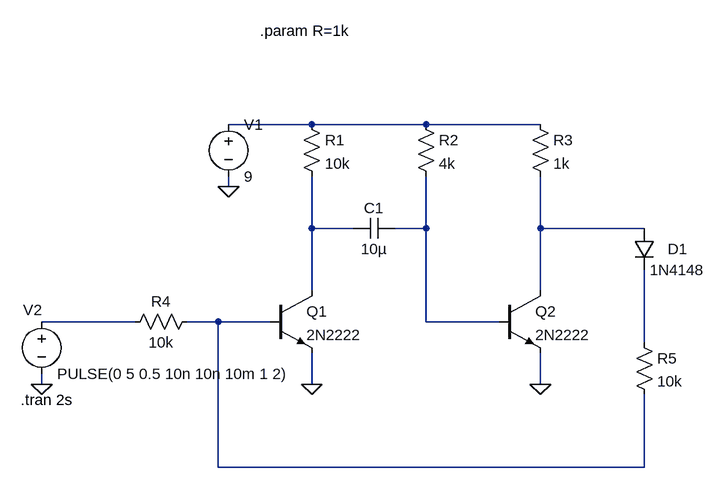
[diagram p0: schematic pulse_generator.asc]
pulse_generator.asc, the LTspice schematic file:
Version 4
SHEET 1 880 740
WIRE 32 64 -96 64
WIRE 208 64 32 64
WIRE 384 64 208 64
WIRE -96 160 -96 144
WIRE 32 224 32 144
WIRE 96 224 32 224
WIRE 208 224 208 144
WIRE 208 224 160 224
WIRE 384 224 384 144
WIRE 544 224 384 224
WIRE 32 320 32 224
WIRE 384 320 384 224
WIRE -240 368 -384 368
WIRE -112 368 -160 368
WIRE -32 368 -112 368
WIRE 208 368 208 224
WIRE 320 368 208 368
WIRE 544 400 544 288
WIRE -384 464 -384 448
WIRE 32 464 32 416
WIRE 384 464 384 416
WIRE -112 592 -112 368
WIRE 544 592 544 480
WIRE 544 592 -112 592
FLAG 32 464 0
FLAG 384 464 0
FLAG -96 160 0
FLAG -384 464 0
SYMBOL res 16 48 R0
SYMATTR InstName R1
SYMATTR Value 10k
SYMBOL res 192 48 R0
SYMATTR InstName R2
SYMATTR Value 4k
SYMBOL res 368 48 R0
SYMATTR InstName R3
SYMATTR Value 1k
SYMBOL res -144 352 R90
WINDOW 0 0 56 VBottom 2
WINDOW 3 32 56 VTop 2
SYMATTR InstName R4
SYMATTR Value 10k
SYMBOL npn -32 320 R0
SYMATTR InstName Q1
SYMATTR Value 2N2222
SYMBOL npn 320 320 R0
SYMATTR InstName Q2
SYMATTR Value 2N2222
SYMBOL cap 160 208 R90
WINDOW 0 0 32 VBottom 2
WINDOW 3 32 32 VTop 2
SYMATTR InstName C1
SYMATTR Value 10µ
SYMBOL voltage -96 48 R0
WINDOW 123 0 0 Left 0
WINDOW 39 0 0 Left 0
SYMATTR InstName V1
SYMATTR Value 9
SYMBOL voltage -384 352 R0
WINDOW 123 0 0 Left 0
WINDOW 39 0 0 Left 0
WINDOW 0 -28 -2 Left 2
SYMATTR InstName V2
SYMATTR Value PULSE(0 5 0.5 10n 10n 10m 1 2)
SYMBOL diode 528 224 R0
WINDOW 0 52 32 Left 2
SYMATTR InstName D1
SYMATTR Value 1N4148
SYMBOL res 528 384 R0
SYMATTR InstName R5
SYMATTR Value 10k
TEXT -48 -80 Left 2 !.param R=1k
TEXT -416 488 Left 2 !.tran 2s

The netlist it stands for:
* pulse_generator.asc
R1 N001 N002 10k
R2 N001 N003 4k
R3 N001 N004 1k
R4 N006 N005 10k
Q1 N002 N006 0 0 2N2222
Q2 N004 N003 0 0 2N2222
C1 N003 N002 10µ
V1 N001 0 9
V2 N005 0 PULSE(0 5 0.5 10n 10n 10m 1 2)
D1 N004 N007 1N4148
R5 N007 N006 10k
.model D D
.lib standard.dio
.model NPN NPN
.model PNP PNP
.lib standard.bjt
.param R=1k
.tran 2s
.backanno
.end